# EAGLE design countdown (EAGLE 9.6.1)
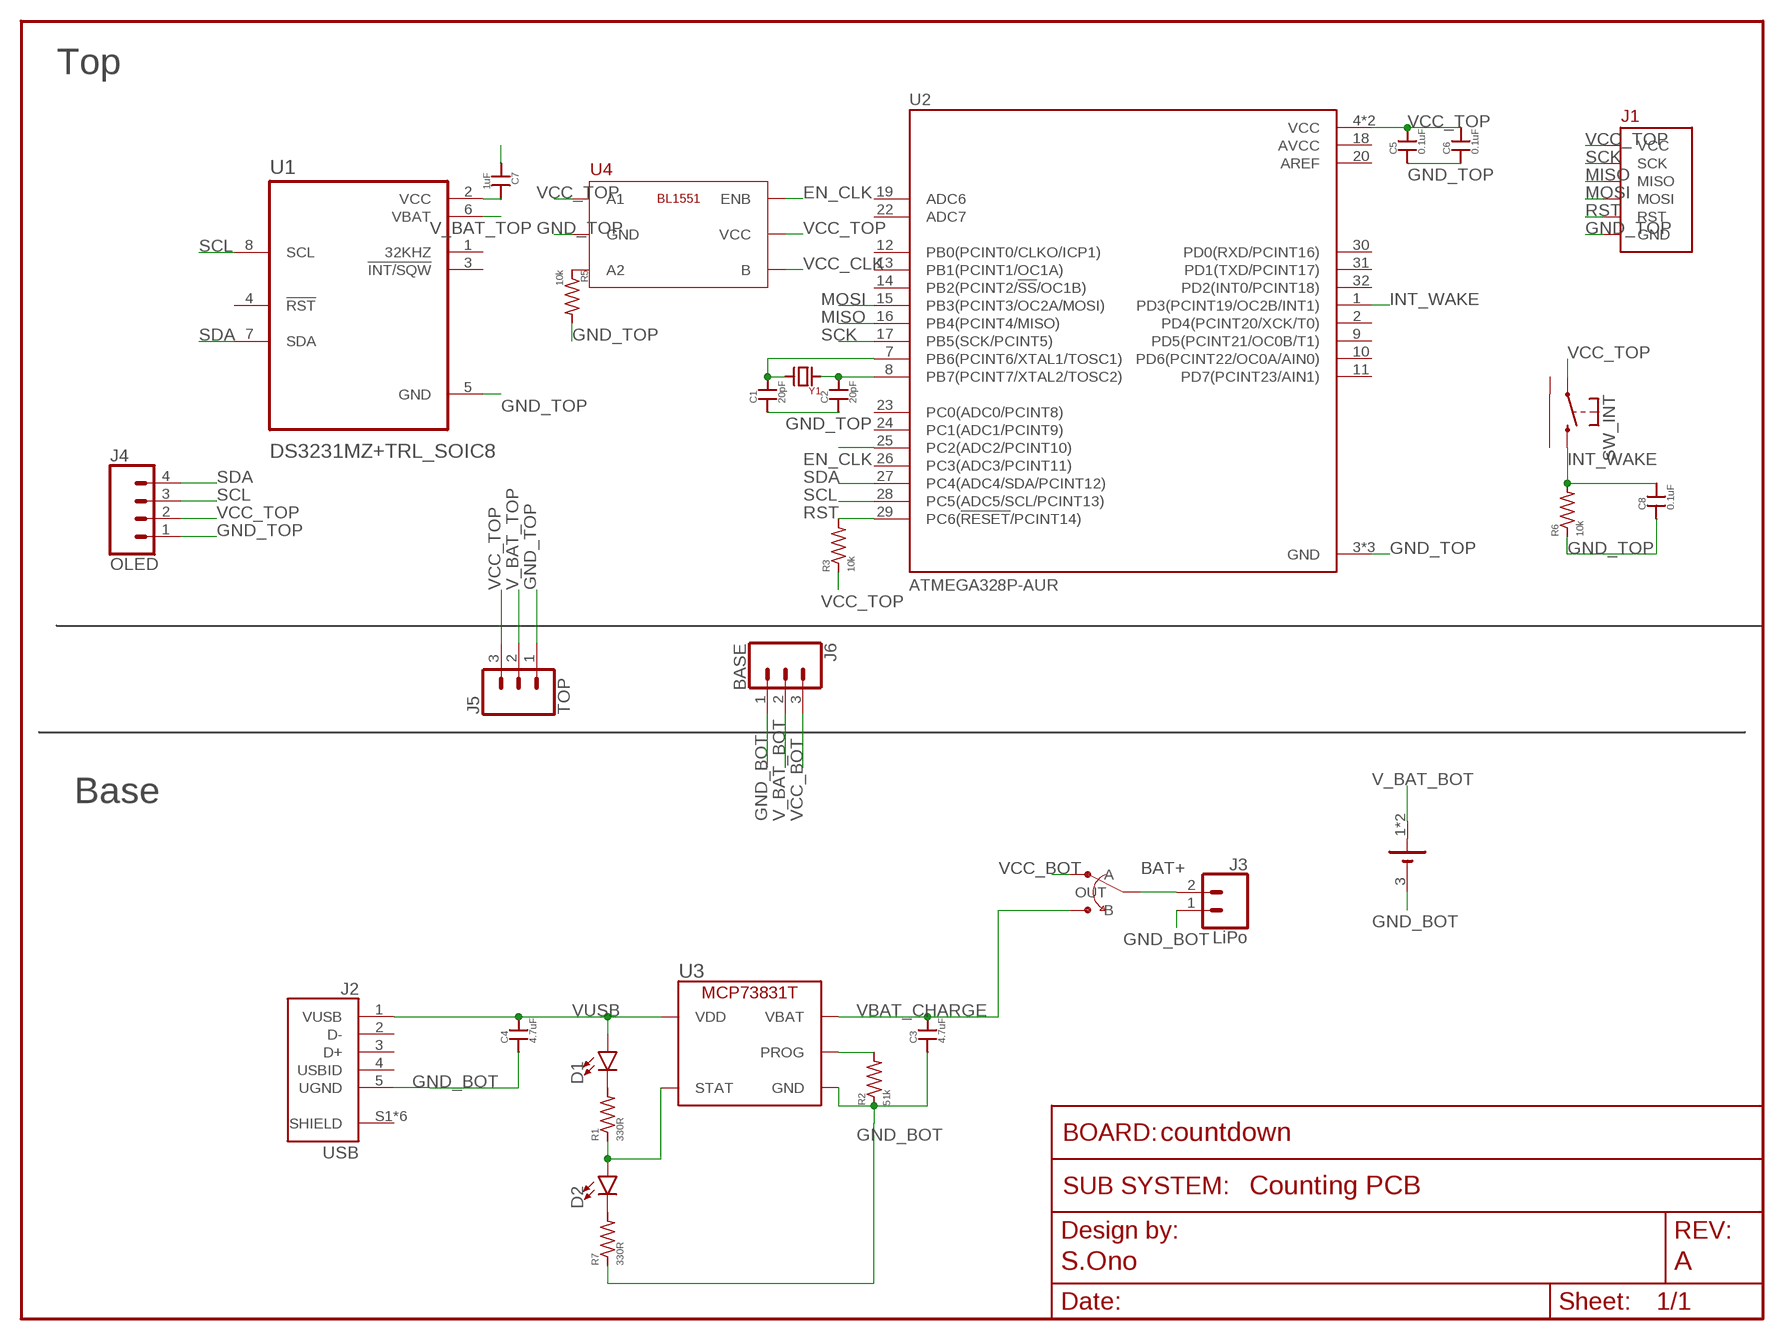
[diagram p0: schematic, sheet 1]
FRAME1 (FRAME_SCHEMATIC): AUTHOR: S.Ono; REV: A; SUBSYSTEM_NAME: Counting PCB

## Parts
BT1  BK-916-TR  [BAT_BK-916-TR]
C1  20pF  CAP0402-CAP  [0402-CAP]
C2  20pF  CAP0402-CAP  [0402-CAP]
C3  4.7uF  CAP0402-CAP  [0402-CAP]
C4  4.7uF  CAP0402-CAP  [0402-CAP]
C5  0.1uF  CAP0402-CAP  [0402-CAP]
C6  0.1uF  CAP0402-CAP  [0402-CAP]
C7  1uF  CAP0402-CAP  [0402-CAP]
C8  0.1uF  CAP0402-CAP  [0402-CAP]
D1  LED0603  [LED-0603]
D2  LED0603  [LED-0603]
J1  BURNIN  [BURNIN]
J2  USB  [FCI_10103594-0001LF]
J3  LiPo  CONN_02  [1X02]
J4  OLED  CONN_041X04_NO_SILK  [1X04_NO_SILK]
J5  TOP  CONN_031X03_NO_SILK  [1X03_NO_SILK]
J6  BASE  CONN_031X03_NO_SILK  [1X03_NO_SILK]
R1  330R  R-US_R0402  [R0402]
R2  51k  R-US_R0402  [R0402]
R3  10k  R-US_R0402  [R0402]
R5  10k  R-US_R0402  [R0402]
R6  10k  R-US_R0402  [R0402]
R7  330R  R-US_R0402  [R0402]
SW_INT  FSMRACD  [FSMRACD]
U1  DS3231MZ+TRL_SOIC8  [SOIC-8]
U2  ATMEGA328P-AUR  [QFP80P900X900X120-32N]
U3  MCP73831T  [SOT-23-5]
U4  BL1551  [SOT-363]
U$1  CL-SB-12C-12  [12C-12]
Y1  CRYSTAL_5032  [XTAL500X320X130N]

## Nets
BAT+: J3.2 U$1.2(OUT)
EN_CLK: U2.25(PC2(ADC2/PCINT10)) U4.6(ENB)
GND_BOT: BT1.3(-) C3.1 C4.1 J2.5(UGND) J3.1 J6.1 R2.1 R7.1 U3.2(GND)
GND_TOP: C1.1 C2.1 C5.1 C6.1 C7.1 C8.1 J1.GND J4.1 J5.1 R5.2 R6.1 U1.5(GND) U2.3(GND) U2.5(GND) U2.21(GND) U4.2(GND)
INT_WAKE: C8.2 R6.2 SW_INT.P$2(S) U2.1(PD3(PCINT19/OC2B/INT1))
MISO: J1.MISO U2.16(PB4(PCINT4/MISO))
MOSI: J1.MOSI U2.15(PB3(PCINT3/OC2A/MOSI))
N$1: R5.1 U4.3(A2)
N$2: D2.C R7.2
N$4: D1.C R1.2
PROG: R2.2 U3.5(PROG)
RST: J1.RST R3.2 U2.29(PC6(!RESET!/PCINT14))
SCK: J1.SCK U2.17(PB5(SCK/PCINT5))
SCL: J4.3 U1.8(SCL) U2.28(PC5(ADC5/SCL/PCINT13))
SDA: J4.4 U1.7(SDA) U2.27(PC4(ADC4/SDA/PCINT12))
STAT: D2.A R1.1 U3.1(STAT)
V_BAT_BOT: BT1.1(+) BT1.2(+) J6.2
V_BAT_TOP: J5.2 U1.6(VBAT)
VBAT_CHARGE: C3.2 U3.3(VBAT) U$1.3(B)
VCC_BOT: J6.3 U$1.1(A)
VCC_CLK: C7.2 U1.2(VCC) U4.4(B)
VCC_TOP: C5.2 C6.2 J1.3.3V(VCC) J4.2 J5.3 R3.1 SW_INT.P$1(P) U2.4(VCC) U2.6(VCC) U4.1(A1) U4.5(VCC)
VUSB: C4.2 D1.A J2.1(VUSB) U3.4(VDD)
XTAL1: C1.2 U2.7(PB6(PCINT6/XTAL1/TOSC1)) Y1.2(B)
XTAL2: C2.2 U2.8(PB7(PCINT7/XTAL2/TOSC2)) Y1.1(A)
Unconnected: J2.2(D-) J2.3(D+) J2.4(USBID) J2.S1(SHIELD) J2.S2(SHIELD) J2.S3(SHIELD) J2.S4(SHIELD) J2.S5(SHIELD) J2.S6(SHIELD) SW_INT.GND1 SW_INT.GND2 U1.1(32KHZ) U1.3(!INT/SQW) U1.4(!RST) U2.2(PD4(PCINT20/XCK/T0)) U2.9(PD5(PCINT21/OC0B/T1)) U2.10(PD6(PCINT22/OC0A/AIN0)) U2.11(PD7(PCINT23/AIN1)) U2.12(PB0(PCINT0/CLKO/ICP1)) U2.13(PB1(PCINT1/OC1A)) U2.14(PB2(PCINT2/!SS!/OC1B)) U2.19(ADC6) U2.22(ADC7) U2.23(PC0(ADC0/PCINT8)) U2.24(PC1(ADC1/PCINT9)) U2.26(PC3(ADC3/PCINT11)) U2.30(PD0(RXD/PCINT16)) U2.31(PD1(TXD/PCINT17)) U2.32(PD2(INT0/PCINT18))

## Notes on the sheet
- Top
- Base

## Power pins joined to a net without a drawn wire
AREF: U2.20(AREF)
AVCC: U2.18(AVCC)

## Library data of the parts
BT1 = scono:BK-916-TR: Cr1220, 1225 Battery Retainer w/; DESCRIPTION: Battery Retainer Coin, 12.0mm 1 Cell SMD _SMT_ Tab; DIGI-KEY_PART_NUMBER: BK-916-CT-ND; MF: MPD _Memory; MP: BK-916-TR; PACKAGE: MSOP-12 Memory Protection Devices
C1-C8 = scono:CAP: Capacitor Standard 0603 ceramic capacitor, and 0.1" leaded capacitor.; PIE-INT-REF-NUM: CAPACITOR-GENERIC
D1 D2 = scono:LED: https://www.digikey.com/products/en/optoelectronics/led-indication-discrete/105?k=&pkeyword=&pv7=2&pv1989=0&pv16=5&FV=ffe00069&quantity=0&ColumnSort=0&page=1&pageSize=25
J1 = scono:BURNIN
J2 = scono:USB: Micro Usb, 2.0 Type b, Receptacle, Smt; DESCRIPTION: Micro Usb, 2.0 Type b, Receptacle, Smt; DIGI-KEY_PART_NUMBER: 609-4050-1-ND; DIGI-KEY_PURCHASE_URL: https://www.digikey.com/product-detail/en/amphenol-icc-fci/10103594-0001LF/609-4050-1-ND/2350357?utm_source=snapeda&utm_medium=aggregator&utm_campaign=symbol; MF: Amphenol ICC; MP: 10103594-0001LF; PACKAGE: None
J3 = scono:CONN_02: Multi connection point. Often used as Generic Header-pin footprint for 0.1 inch spaced/style header connections On any of the 0.1 inch spaced packages, you can populate with these: Break Away Headers - Straight <https://www.sparkfun.com/products/116> (PRT-00116) Break Away Male Headers - Right Angle <https://www.sparkfun.com/products/553> (PRT-00553) Female Headers <https://www.sparkfun.com/products/115> (PRT-00115) Break Away Headers - Machine Pin <https://www.sparkfun.com/products/117> (PRT-00117) Break Away Female Headers - Swiss Machine Pin <https://www.sparkfun.com/products/743> (PRT-00743) For SCREWTERMINALS and SPRING TERMINALS visit here: Screw Terimnals on SparkFun.com <https://www.sparkfun.com/search/results?term=Screw+Terminals> (5mm/3.5mm/2.54mm spacing) This device is also useful as a general connection point to wire up your design to another part of your project. Our various solder wires solder well into these plated through hole pads. Hook-Up Wire - Assortment (Stranded, 22 AWG) <https://www.sparkfun.com/products/11375> (PRT-11375) Hook-Up Wire - Assortment (Solid Core, 22 AWG) <https://www.sparkfun.com/products/11367> (PRT-11367) View the entire wire category on our website here <https://www.sparkfun.com/categories/141> Special notes: Molex polarized connector foot print use with: PRT-08233 with associated crimp pins and housings. 2.54_SCREWTERM for use with PRT-10571. 3.5mm Screw Terminal footprints for PRT-08084 5mm Screw Terminal footprints for use with PRT-08432
J4 = scono:CONN_04: Multi connection point. Often used as Generic Header-pin footprint for 0.1 inch spaced/style header connections On any of the 0.1 inch spaced packages, you can populate with these: Break Away Headers - Straight <https://www.sparkfun.com/products/116> (PRT-00116) Break Away Male Headers - Right Angle <https://www.sparkfun.com/products/553> (PRT-00553) Female Headers <https://www.sparkfun.com/products/115> (PRT-00115) Break Away Headers - Machine Pin <https://www.sparkfun.com/products/117> (PRT-00117) Break Away Female Headers - Swiss Machine Pin <https://www.sparkfun.com/products/743> (PRT-00743) For SCREWTERMINALS and SPRING TERMINALS visit here: Screw Terimnals on SparkFun.com <https://www.sparkfun.com/search/results?term=Screw+Terminals> (5mm/3.5mm/2.54mm spacing) This device is also useful as a general connection point to wire up your design to another part of your project. Our various solder wires solder well into these plated through hole pads. Hook-Up Wire - Assortment (Stranded, 22 AWG) <https://www.sparkfun.com/products/11375> (PRT-11375) Hook-Up Wire - Assortment (Solid Core, 22 AWG) <https://www.sparkfun.com/products/11367> (PRT-11367) View the entire wire category on our website here <https://www.sparkfun.com/categories/141> Special notes: Molex polarized connector foot print use with SKU : PRT-08231 with associated crimp pins and housings. 1MM SMD Version SKU: PRT-10208; PROD_ID: CONN-09696
J5 J6 = scono:CONN_03: Multi connection point. Often used as Generic Header-pin footprint for 0.1 inch spaced/style header connections On any of the 0.1 inch spaced packages, you can populate with these: Break Away Headers - Straight <https://www.sparkfun.com/products/116> (PRT-00116) Break Away Male Headers - Right Angle <https://www.sparkfun.com/products/553> (PRT-00553) Female Headers <https://www.sparkfun.com/products/115> (PRT-00115) Break Away Headers - Machine Pin <https://www.sparkfun.com/products/117> (PRT-00117) Break Away Female Headers - Swiss Machine Pin <https://www.sparkfun.com/products/743> (PRT-00743) Stackable Header - 3 Pin (Female, 0.1") <https://www.sparkfun.com/products/13875> (PRT-13875) For SCREWTERMINALS and SPRING TERMINALS visit here: Screw Terimnals on SparkFun.com <https://www.sparkfun.com/search/results?term=Screw+Terminals> (5mm/3.5mm/2.54mm spacing) This device is also useful as a general connection point to wire up your design to another part of your project. Our various solder wires solder well into these plated through hole pads. Hook-Up Wire - Assortment (Stranded, 22 AWG) <https://www.sparkfun.com/products/11375> (PRT-11375) Hook-Up Wire - Assortment (Solid Core, 22 AWG) <https://www.sparkfun.com/products/11367> (PRT-11367) View the entire wire category on our website here <https://www.sparkfun.com/categories/141> Special notes: Molex polarized connector foot print use with SKU : PRT-08232 with associated crimp pins and housings.
R1-R3 R5-R7 = scono:R-US_: RESISTOR, American symbol
SW_INT = scono:FSMRACD; COMMENT: 9-1437565-9; CONFIGURATION_POLE-THROW: Single Pole - Single Throw; CONTACT_CURRENT_RATING: 50 mA; DESCRIPTION: Tactile Switch SPST-NO Side Actuated Through Hole, Right Angle; DIGI-KEY_PART_NUMBER: 450-1178-ND; DIGIKEY-PURCHASE-URL: https://snapeda.com/shop?store=DigiKey&id=1919694; EU_ROHS_COMPLIANCE: Compliant; MF: TE Connectivity; MP: FSMRACD; PACKAGE: None
U1 = scono:DS3231MZ+TRL
U2 = scono:ATMEGA328P-AUR: ATmega328P Series 8 Bit 2 kB RAM 32 kB Flash SMT Microcontroller - TQFP-32; DESCRIPTION: ATmega328P Series 8 Bit 2 kB RAM 32 kB Flash SMT Microcontroller - TQFP-32; DIGI-KEY_PART_NUMBER: ATMEGA328P-AURCT-ND; DIGI-KEY_PURCHASE_URL: https://www.digikey.com/product-detail/en/microchip-technology/ATMEGA328P-AUR/ATMEGA328P-AURCT-ND/3789455?utm_source=snapeda&utm_medium=aggregator&utm_campaign=symbol; MF: Microchip; MP: ATMEGA328P-AUR; PACKAGE: TQFP-32 Microchip
U3 = scono:MCP73831T: https://www.digikey.com/product-detail/en/microchip-technology/MCP73831T-2ACI-OT/MCP73831T-2ACI-OTCT-ND/1979802
U4 = scono:BL1551
U$1 = scono:CL-SB-12C-12
Y1 = scono:CRYSTAL

## Board
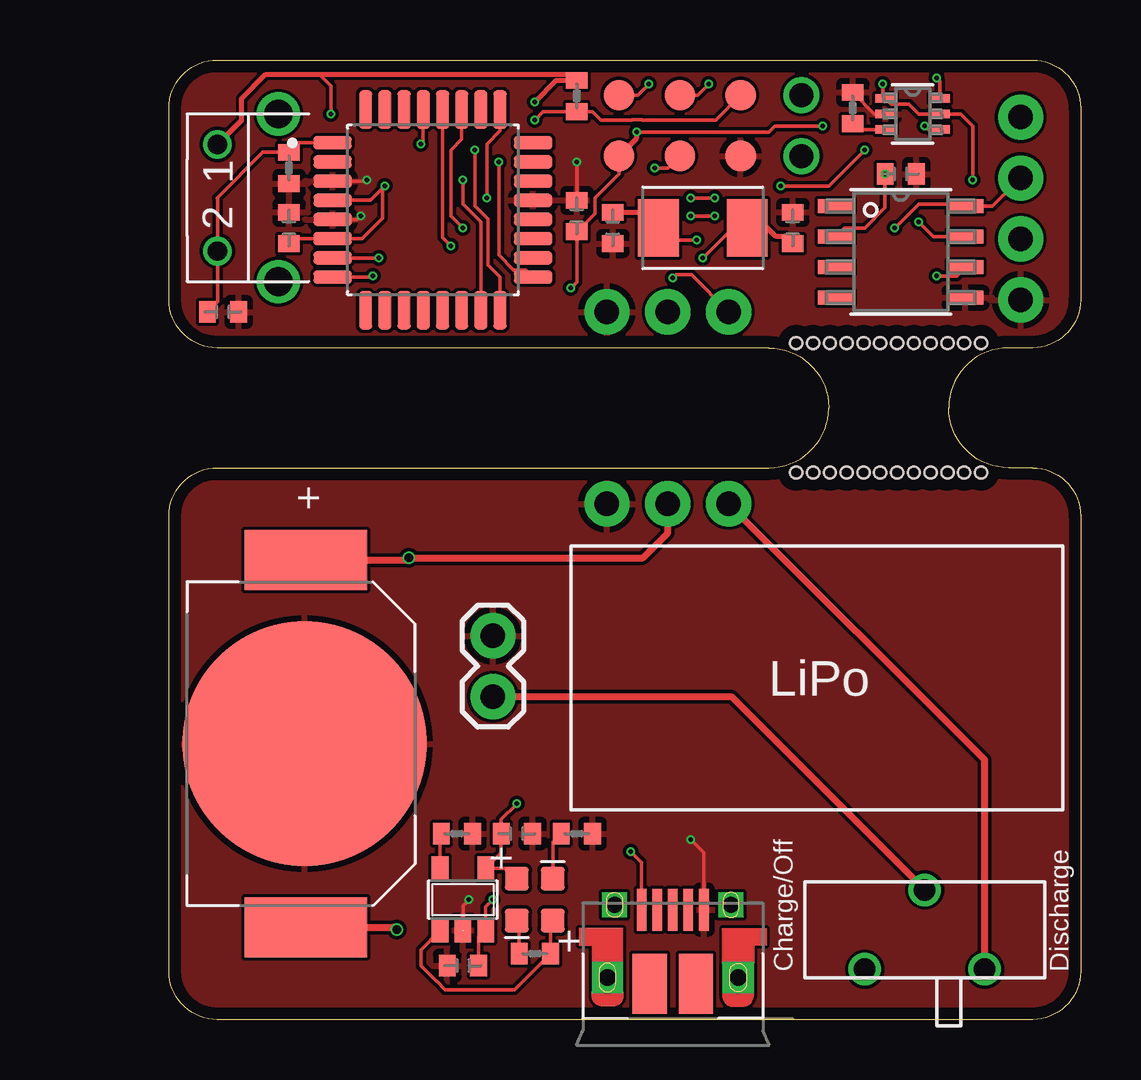
[diagram p1: board, top side]
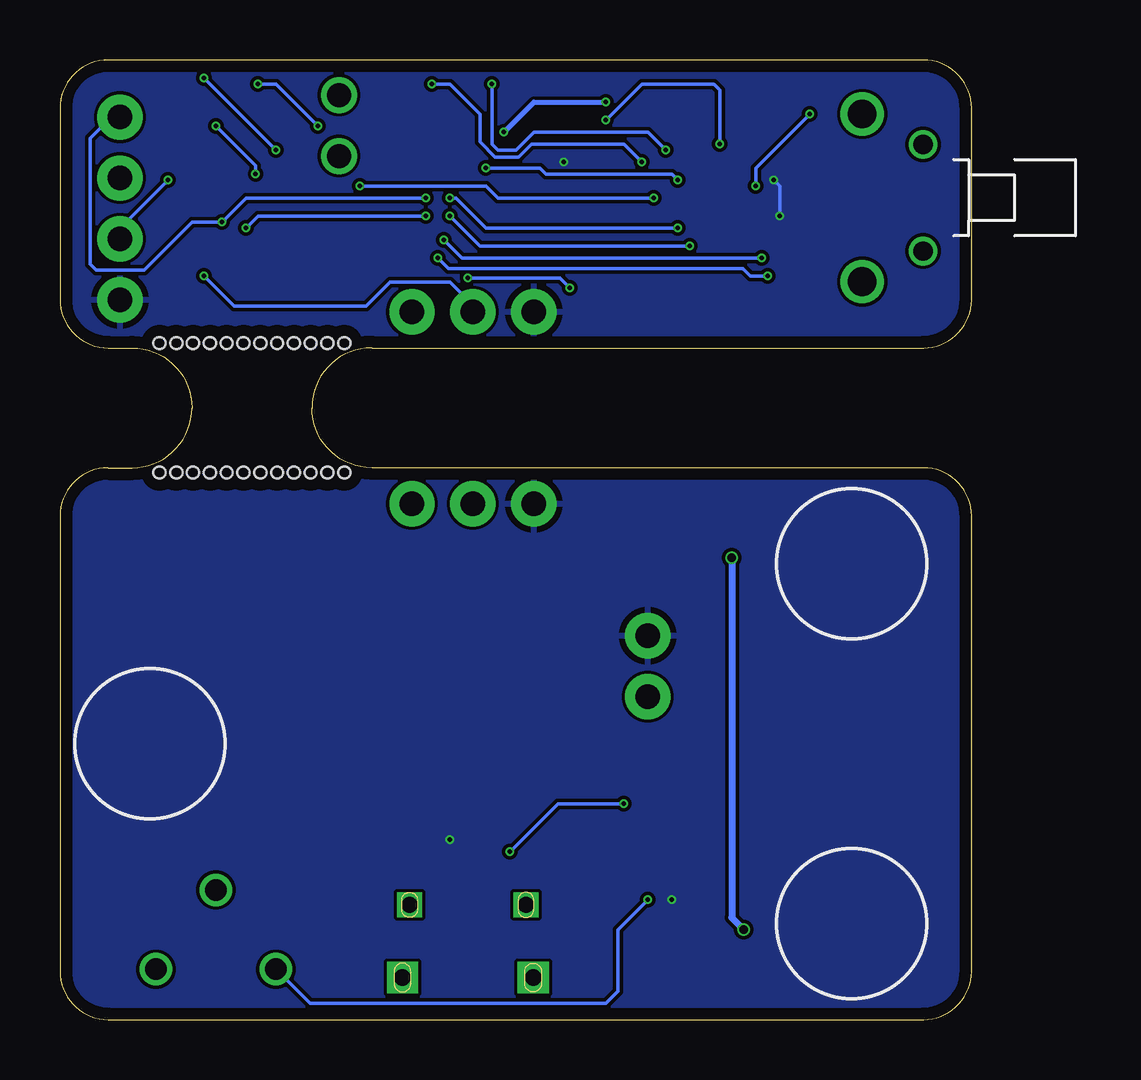
[diagram p2: board, bottom side, seen from below]

Size 38 x 40 mm. Coordinates in mm from the lower left corner, seen from the top.
Outline: 2,40 36,40 arc-90 38,38 38,30 arc-90 36,28 35,28 arc90 32.5,25.5 arc90 35,23 36,23 arc-90 38,21 38,2 arc-90 36,0 2,0 arc-90 0,2 0,21 arc-90 2,23 25,23 arc90 27.5,25.5 arc90 25,28 2,28 arc-90 0,30 0,38 arc-90 2,40
Copper layers (1*16): Top 2mil / dielectric 9mil / Bottom 2mil
Design rules "scono": minimum track width 3.5mil, minimum drill 0.2mm, track to track 5.5mil, track to pad 5.5mil, pad to pad 5.5mil, via to via 5.5mil, smd to smd 0mil, copper to edge 0.5mm, drill to drill 0.5mm, minimum pad ring 3mil, minimum via ring 3mil, stop-mask expansion 3mil, vias tented up to drill 0mil, thermal gap 10mil
Holes 0.5 mm at 28.25,28.2 27.55,28.2 26.85,28.2 26.15,28.2 28.95,28.2 31.75,28.2 31.05,28.2 30.35,28.2 29.65,28.2 32.45,28.2 33.85,28.2 33.15,28.2 31.75,22.8 32.45,22.8 33.15,22.8 33.85,22.8 31.05,22.8 28.25,22.8 28.95,22.8 29.65,22.8 30.35,22.8 27.55,22.8 26.15,22.8 26.85,22.8

### Footprints (pad centres in the part's own frame; a part is rotated, then mirrored left to right if it is on the bottom)
BAT_BK-916-TR = smd 2.5 x 5.1: 1 -7.65,0.05; 2 7.65,0.05 | smd 10.2 x 10.2: 3 0,0
0402-CAP = smd 0.7 x 0.9: 1 -0.65,0; 2 0.65,0
LED-0603 = smd 1 x 1: A 0.877,0; C -0.877,0
BURNIN = smd 1.27 x 1.27 bottom: 3.3V 0,0; GND -5.08,0; MISO 0,2.54; MOSI -2.54,0; RST -5.08,2.54; SCK -2.54,2.54 | drill 1: P$7 -7.62,2.54; P$8 -7.62,0
FCI_10103594-0001LF = smd 0.4 x 1.75: 1 -1.3,2.825; 2 -0.65,2.825; 3 0,2.825; 4 0.65,2.825; 5 1.3,2.825 | smd 1.425 x 2.5: S1 -0.963,-0.25; S2 0.963,-0.25 | drill 0.65 pad 1.05 square: S3 -2.425,3.03; S4 2.425,3.03 | drill 0.7 pad 1.3 square: S5 -2.725,0; S6 2.725,0
1X02 = drill 1.016 pad 1.88: 1 0,0; 2 2.54,0
1X04_NO_SILK = drill 1.016 pad 1.88: 1 0,0; 2 2.54,0; 3 5.08,0; 4 7.62,0
1X03_NO_SILK = drill 1.016 pad 1.88: 1 0,0; 2 2.54,0; 3 5.08,0
R0402 = smd 0.7 x 0.9: 1 -0.65,0; 2 0.65,0
FSMRACD = drill 1.2: GND1 0,3.81; GND2 6.985,3.81 | drill 0.8: P$1 1.27,1.27; P$2 5.715,1.27
SOIC-8 = smd 1.493 x 0.568: 1 -2.702,1.905; 2 -2.702,0.635; 3 -2.702,-0.635; 4 -2.702,-1.905; 5 2.702,-1.905; 6 2.702,-0.635; 7 2.702,0.635; 8 2.702,1.905
QFP80P900X900X120-32N = smd 1.6 x 0.55: 1 -4.18,2.8; 2 -4.18,2; 3 -4.18,1.2; 4 -4.18,0.4; 5 -4.18,-0.4; 6 -4.18,-1.2; 7 -4.18,-2; 8 -4.18,-2.8; 17 4.18,-2.8; 18 4.18,-2; 19 4.18,-1.2; 20 4.18,-0.4; 21 4.18,0.4; 22 4.18,1.2; 23 4.18,2; 24 4.18,2.8 | smd 0.55 x 1.6: 9 -2.8,-4.18; 10 -2,-4.18; 11 -1.2,-4.18; 12 -0.4,-4.18; 13 0.4,-4.18; 14 1.2,-4.18; 15 2,-4.18; 16 2.8,-4.18; 25 2.8,4.18; 26 2,4.18; 27 1.2,4.18; 28 0.4,4.18; 29 -0.4,4.18; 30 -1.2,4.18; 31 -2,4.18; 32 -2.8,4.18
SOT-23-5 = smd 0.69 x 0.99: 1 -0.95,-1.29; 2 0,-1.29; 3 0.95,-1.29; 4 0.95,1.3; 5 -0.95,1.3
SOT-363 = smd 0.845 x 0.365: 1 -1.134,0.65; 2 -1.134,0; 3 -1.134,-0.65; 4 1.134,-0.65; 5 1.134,0; 6 1.134,0.65
12C-12 = drill 0.9: 1 -2.5,1.65; 2 0,-1.65; 3 2.5,1.65
XTAL500X320X130N = smd 1.7 x 2.4: 1 -1.85,0; 2 1.85,0

### Placement (x,y rotation side)
BT1  5.65,11.5 270 top
C1  18.5,33 90 top
C2  26,33 270 top
C3  12.25,2.25 0 top
C4  14.5,7.75 180 top
C5  17,33.5 270 top
C6  5,33 270 top
C7  30.5,35.25 180 top
C8  2.25,29.5 180 top
D1  14.5,5 90 top
D2  16,5 270 top
J1  18.75,36 0 bottom
J2  21,1.75 0 top
J3  13.5,16 270 top
J4  35.5,30 90 top
J5  18.25,29.5 0 top
J6  18.25,21.5 0 top
R1  15.25,2.75 180 top
R2  12,7.75 180 top
R3  17,38.5 270 top
R5  28.5,38 90 top
R6  5,35.5 90 top
R7  17,7.75 180 top
SW_INT  0.75,37.75 270 top
U1  30.5,32 0 top
U2  11,33.75 0 top
U3  12.25,5 0 top
U4  31,37.75 0 top
U$1  31.5,3.75 180 top
Y1  22.25,33 180 top

### Tracks (layer width: path | path; a pad name or v marks a point on that pad's centre or on a via)
BAT+
  Top 0.3: J3.2 23.44,13.46 U$1.2
EN_CLK  (via drill 0.2)
  Top 0.152: U4.6 32.13,39.12 v32,39.25 | v29,36.25 27.5,34.75 v25.5,34.75 | U2.25 13.8,37.05 13.25,36.5 v13.25,34.25
  Bottom 0.152: v32,39.25 v29,36.25 | v25.5,34.75 20.25,34.75 19.75,34.25 v13.25,34.25
GND_BOT  (via drill 0.2)
  Top 0.152: J2.5 22.3,6.95 v21.75,7.5 | v12.5,5 12.25,4.75 U3.2
  pour Bottom: 0,23 38,23 38,0 0,0
  pour Top: 0,23 38,23 38,0 0,0
GND_TOP  (via drill 0.2)
  Top 0.152: C5.1 v17,35.75 | U4.2 29.4,37.75 R5.2 | U2.5 7.85,33.35 v8,33.5 | v8.25,35 8.2,34.95 U2.3
  Bottom 0.152: v8,33.5 8,34.75 v8.25,35
  pour Bottom: 0,40 38,40 38,28 0,28
  pour Top: 0,40 38,40 38,28 0,28
INT_WAKE
  Top 0.152: U2.1 5.4,36.55 R6.2 3.9,36.15 2,34.25 2.02,34.23 SW_INT.P$2 2.02,29.92 C8.2
MISO  (via drill 0.2)
  Top 0.152: J1.MISO 19.54,38.54 v20,39 | U2.16 13.8,30.95 13.29,31.46 13.29,33.37 12.75,33.91 v12.75,36.25
  Bottom 0.152: v12.75,36.25 13.5,37 18.25,37 19,36.25 19.75,36.25 20,36.5 v20,39
MOSI  (via drill 0.2)
  Top 0.152: J1.MOSI 20.79,35.5 v20.25,35.5 | U2.15 13,33.25 12.25,34 v12.25,35
  Bottom 0.152: v12.25,35 12.5,35.25 17.75,35.25 18,35.5 v20.25,35.5
N$1
  Top 0.152: U4.3 28.75,37.1 R5.1
N$2
  Top 0.152: D2.C 16,7.4 R7.2
N$4
  Top 0.152: D1.C 14.56,4.06 14.6,4.02 R1.2
PROG
  Top 0.152: R2.2 11.3,7.7 U3.5
RST  (via drill 0.2)
  Top 0.152: U2.29 10.6,36.6 v10.5,36.5 | v15.25,37.5 15.6,37.85 R3.2 17.65,37.85 18,37.5 19.28,37.5 19.29,37.51 19.71,37.51 19.72,37.5 22.79,37.5 J1.RST
  Bottom 0.152: v10.5,36.5 10.5,38.75 10.75,39 13.75,39 v15.25,37.5
SCK  (via drill 0.2)
  Top 0.152: J1.SCK 22.04,38.54 v22.5,39 | U2.17 14.88,31.25 14.37,31.25 13.75,31.86 v13.75,35.75
  Bottom 0.152: v13.75,35.75 14.5,36.5 18.34,36.5 18.88,35.96 19.87,35.96 20.5,36.59 20.5,37.75 21.75,39 v22.5,39
SCL  (via drill 0.2)
  Top 0.152: J4.3 34.33,33.91 U1.8 33.11,34 31.25,34 v30.25,33 | U2.28 11.4,32.6 v11.75,32.25 | v21.75,33.5 v22.75,33.5
  Bottom 0.152: v11.75,32.25 20.5,32.25 v21.75,33.5 | v22.75,33.5 29.75,33.5 v30.25,33
SDA  (via drill 0.2)
  Top 0.152: U1.7 31.86,32.63 v31.25,33.25 | U2.27 12.2,36.7 11.75,36.25 11.75,33.5 v12.25,33 | v21.75,34.25 v22.75,34.25
  Bottom 0.152: J4.4 35.88,37.62 36.75,36.75 36.75,31.5 36.5,31.25 34.5,31.25 32.5,33.25 v31.25,33.25 30.25,34.25 v22.75,34.25 | v12.25,33 20.25,33 21.5,34.25 v21.75,34.25
STAT
  Top 0.152: U3.1 10.5,2.91 10.5,2.25 11.16,1.58 11.17,1.58 11.5,1.25 14.4,1.25 R1.1 15.9,4.02 D2.A
V_BAT_BOT  (via drill 0.35)
  Top 0.3: BT1.1 9.9,19.15 v10,19.25 19.75,19.25 20.79,20.29 J6.2 | BT1.2 9.4,3.85 v9.5,3.75
  Bottom 0.3: v10,19.25 10,4.25 v9.5,3.75
V_BAT_TOP  (via drill 0.2)
  Top 0.152: U1.6 32.84,31 v32,31
  Bottom 0.152: v32,31 30.75,29.75 25.25,29.75 24.25,30.75 21.75,30.75 20.79,29.79 J5.2
VBAT_CHARGE  (via drill 0.2)
  Top 0.152: U3.3 13.2,3.75 | 13.2,3.75 13.2,4.7 v13.5,5 | C3.2 12.9,3.45 13.2,3.75
  Bottom 0.152: v13.5,5 14.75,3.75 14.75,1.18 15.25,0.68 27.58,0.68 U$1.3
VCC_BOT
  Top 0.3: U$1.1 34,10.83 J6.3
VCC_CLK  (via drill 0.2)
  Top 0.152: U1.2 28.16,33 29,33 29.85,33.85 C7.2 | U4.4 31.65,37.1 v31.5,37.25
  Bottom 0.152: C7.2 29.85,35.6 v31.5,37.25
  other vias: 29.85,35.25
VCC_TOP  (via drill 0.2)
  Top 0.152: J5.3 21.77,31.06 21.14,31.06 v21,30.91 | 6.25,39.4 6.75,38.9 v6.75,37.75 | v9,34.75 8.9,34.65 | 8.9,34.65 8.65,34.4 8.4,34.15 U2.4 | 8.9,34.65 8.9,33.4 8.05,32.55 U2.6 5.2,32.55 C6.2 | v29.75,39 29.75,38.52 U4.1 30.1,38.16 30.84,38.16 31.25,37.75 U4.5 33,37.75 33.5,37.25 v33.5,35 | v19.5,37 25,37 25.25,37.25 v27.25,37.25 | J1.3.3V 18.75,35.25 17.75,34.25 17.75,33.6 C5.2 17,31.5 17,30.75 v16.75,30.5
  Top 0.2: SW_INT.P$1 3.02,37.48 3.02,38.39 4.03,39.4 6.25,39.4 16.75,39.4 R3.1 16.15,39.15 v15.25,38.25 | J1.3.3V 19.5,36.75 v19.5,37
  Bottom 0.152: v6.75,37.75 9,35.5 v9,34.75 | v33.5,35 35.5,33 J4.2 | v27.25,37.25 29,39 v29.75,39 | v21,30.91 17.16,30.91 v16.75,30.5
  Bottom 0.2: v19.5,37 19.38,37.12 18.25,38.25 v15.25,38.25
VUSB  (via drill 0.2)
  Top 0.152: v14.5,9 13.85,8.35 C4.2 13.85,6.95 U3.4 14.08,6.3 D1.A | J2.1 19.7,6.55 v19.25,7
  Bottom 0.152: v14.5,9 17.25,9 v19.25,7
XTAL1  (via drill 0.2)
  Top 0.152: v22,32.5 20.9,32.5 Y1.2 | U2.7 v8.75,31.75
  Top 0.2: C1.2 19.75,33.65 Y1.2
  Bottom 0.152: v22,32.5 21.25,31.75 v8.75,31.75
XTAL2  (via drill 0.2)
  Top 0.152: U2.8 8.45,30.95 v8.5,31 | v22.25,31.75 23.5,33 Y1.1
  Top 0.2: Y1.1 24.95,33 25.29,32.66 25.69,32.66 C2.2
  Bottom 0.152: v22.25,31.75 21.81,31.31 9.52,31.31 9.22,31 v8.5,31

### Text on the board
tPlace: LiPo | Charge/Off | Discharge